# Altium schematic sheet PCB_RTM_Loopback.SchDoc: RTM Loopback
size 420 x 297 mm; Author: G.K.; CompanyName: WUT; DrawnBy: G.K.; Organization: CERN; Address1: Warsaw Univeristy of Technology; Address2: Nowowiejska 15/19; Revision: -; SheetNumber: -; SheetTotal: -; EDA_Number: ARTIQ; Projet: SINARA; ModifiedBy: -; CreateDate: XX/XX/XXXX; CheckedDate: -; Title2: Test module; DivGrp: ISE; Designer: G.K.; ModifiedDate: -; ProjectName: SINARA
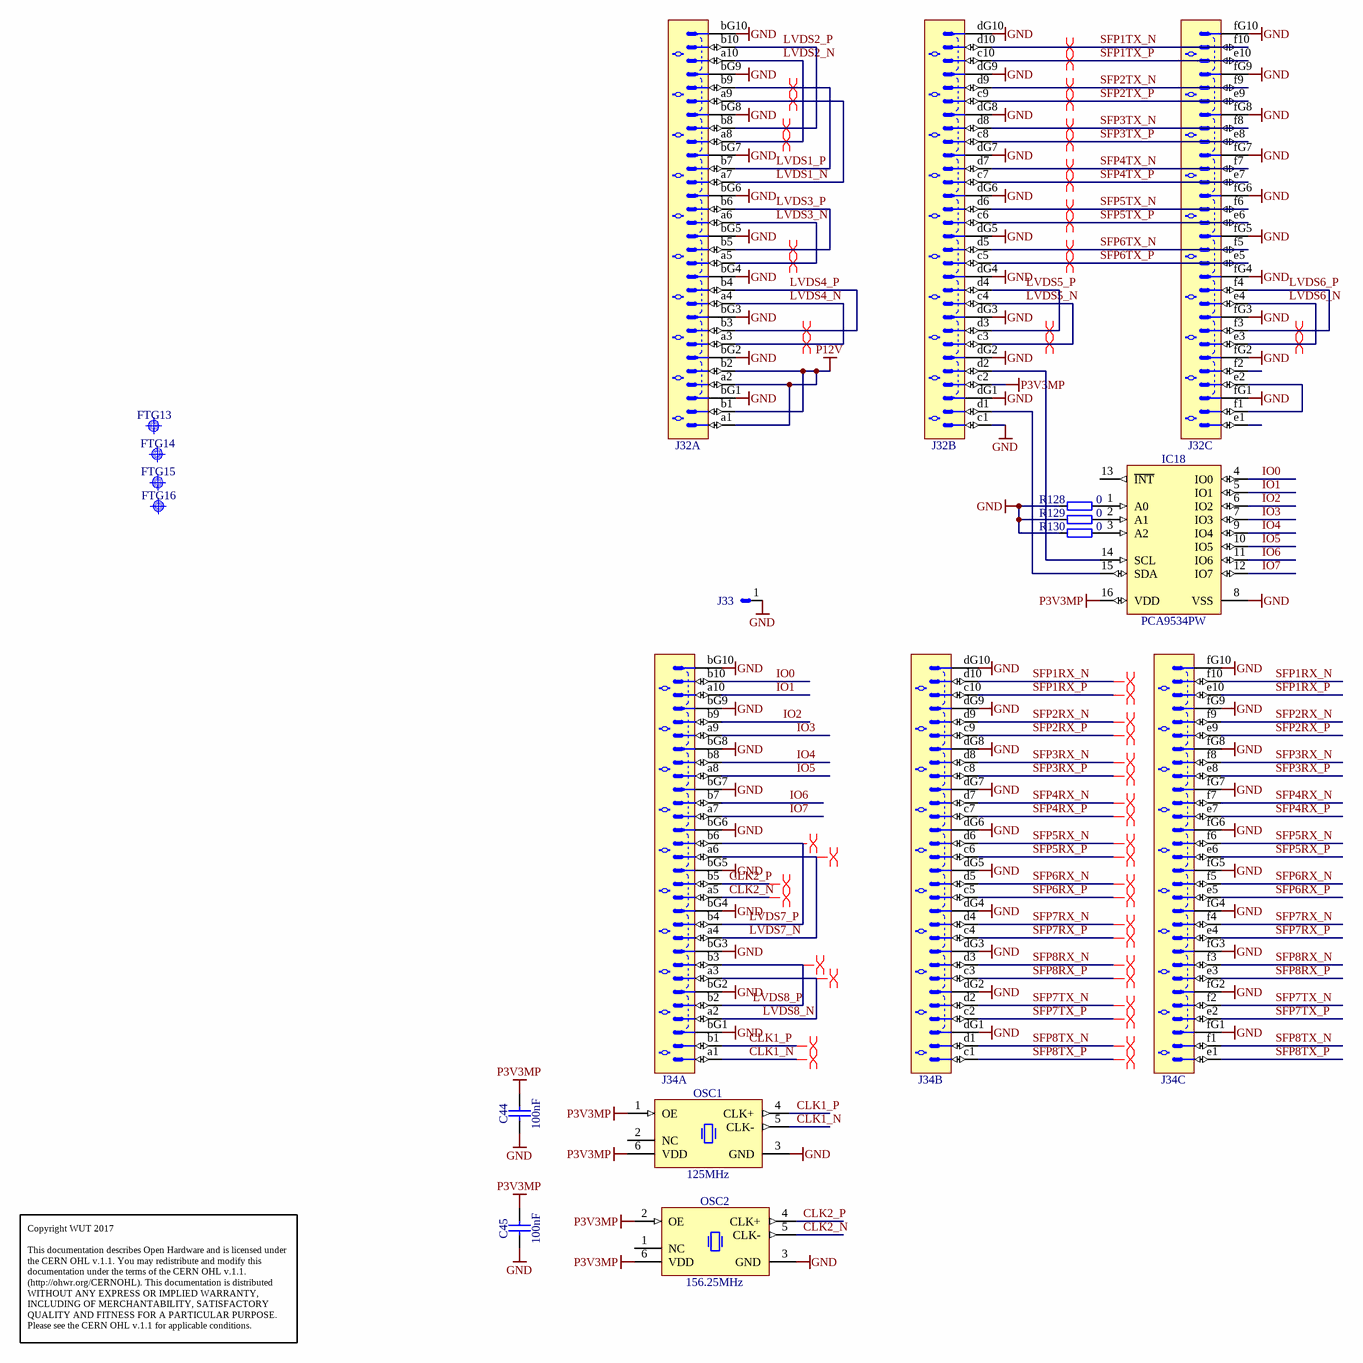
[diagram p0: PCB_RTM_Loopback.SchDoc]

## Parts
C44  100nF  [CAPC1005X55N]
C45  100nF  [CAPC1005X55N]
FTG13  Use only in PCB  [FIDUCIAL_TOP_C100-200]  (value not drawn)
FTG14  Use only in PCB  [FIDUCIAL_TOP_S100-200]  (value not drawn)
FTG15  Use only in PCB  [FIDUCIAL_TOP_S200-400]  (value not drawn)
FTG16  Use only in PCB  [FIDUCIAL_TOP_S100-200]  (value not drawn)
IC18  PCA9534PW  [SOP65P640X110-16N]
J32  (no value)  [TYCO_6469183-1]  (parts A,B,C of 3)
J33  (no value)  [TYCO_1469265-1]
J34  (no value)  [TYCO_6469183-1]  (parts A,B,C of 3)
OSC1  125MHz  [OSC_SILICON-LAB_SI531]
OSC2  156.25MHz  [OSC_SILICON-LAB_SI530]
R128  0  [RESC1005X40N]
R129  0  [RESC1005X40N]
R130  0  [RESC1005X40N]

## Nets
GND: C44.1 C45.1 IC18.8(VSS) J32.bG1 J32.bG2 J32.bG3 J32.bG4 J32.bG5 J32.bG6 J32.bG7 J32.bG8 J32.bG9 J32.bG10 J32.c1 J32.dG1 J32.dG2 J32.dG3 J32.dG4 J32.dG5 J32.dG6 J32.dG7 J32.dG8 J32.dG9 J32.dG10 J32.fG1 J32.fG2 J32.fG3 J32.fG4 J32.fG5 J32.fG6 J32.fG7 J32.fG8 J32.fG9 J32.fG10 J33.1 J34.bG1 J34.bG2 J34.bG3 J34.bG4 J34.bG5 J34.bG6 J34.bG7 J34.bG8 J34.bG9 J34.bG10 J34.dG1 J34.dG2 J34.dG3 J34.dG4 J34.dG5 J34.dG6 J34.dG7 J34.dG8 J34.dG9 J34.dG10 J34.fG1 J34.fG2 J34.fG3 J34.fG4 J34.fG5 J34.fG6 J34.fG7 J34.fG8 J34.fG9 J34.fG10 OSC1.3(GND) OSC2.3(GND) R128.1 R129.1 R130.1
P3V3MP: C44.2 C45.2 IC18.16(VDD) J32.c2 OSC1.1(OE) OSC1.6(VDD) OSC2.2(OE) OSC2.6(VDD)
P12V: J32.a1 J32.a2 J32.b1 J32.b2
CLK1_N: J34.a1 OSC1.5(CLK-)
CLK1_P: J34.b1 OSC1.4(CLK+)
CLK2_N: J34.a5 OSC2.5(CLK-)
CLK2_P: J34.b5 OSC2.4(CLK+)
IO0: IC18.4(IO0) J34.b10
IO1: IC18.5(IO1) J34.a10
IO2: IC18.6(IO2) J34.b9
IO3: IC18.7(IO3) J34.a9
IO4: IC18.9(IO4) J34.b8
IO5: IC18.10(IO5) J34.a8
IO6: IC18.11(IO6) J34.b7
IO7: IC18.12(IO7) J34.a7
LVDS1_N: J32.a7 J32.a9
LVDS1_P: J32.b7 J32.b9
LVDS2_N: J32.a8 J32.a10
LVDS2_P: J32.b8 J32.b10
LVDS3_N: J32.a5 J32.a6
LVDS3_P: J32.b5 J32.b6
LVDS4_N: J32.a3 J32.a4
LVDS4_P: J32.b3 J32.b4
LVDS5_N: J32.c3 J32.c4
LVDS5_P: J32.d3 J32.d4
LVDS6_N: J32.e3 J32.e4
LVDS6_P: J32.f3 J32.f4
LVDS7_N: J34.a4 J34.a6
LVDS7_P: J34.b4 J34.b6
LVDS8_N: J34.a2 J34.a3
LVDS8_P: J34.b2 J34.b3
SFP1RX_N: J34.d10 J34.f10
SFP1RX_P: J34.c10 J34.e10
SFP1TX_N: J32.d10 J32.f10
SFP1TX_P: J32.c10 J32.e10
SFP2RX_N: J34.d9 J34.f9
SFP2RX_P: J34.c9 J34.e9
SFP2TX_N: J32.d9 J32.f9
SFP2TX_P: J32.c9 J32.e9
SFP3RX_N: J34.d8 J34.f8
SFP3RX_P: J34.c8 J34.e8
SFP3TX_N: J32.d8 J32.f8
SFP3TX_P: J32.c8 J32.e8
SFP4RX_N: J34.d7 J34.f7
SFP4RX_P: J34.c7 J34.e7
SFP4TX_N: J32.d7 J32.f7
SFP4TX_P: J32.c7 J32.e7
SFP5RX_N: J34.d6 J34.f6
SFP5RX_P: J34.c6 J34.e6
SFP5TX_N: J32.d6 J32.f6
SFP5TX_P: J32.c6 J32.e6
SFP6RX_N: J34.d5 J34.f5
SFP6RX_P: J34.c5 J34.e5
SFP6TX_N: J32.d5 J32.f5
SFP6TX_P: J32.c5 J32.e5
SFP7RX_N: J34.d4 J34.f4
SFP7RX_P: J34.c4 J34.e4
SFP7TX_N: J34.d2 J34.f2
SFP7TX_P: J34.c2 J34.e2
SFP8RX_N: J34.d3 J34.f3
SFP8RX_P: J34.c3 J34.e3
SFP8TX_N: J34.d1 J34.f1
SFP8TX_P: J34.c1 J34.e1
NetIC18_1: IC18.1(A0) R128.2
NetIC18_2: IC18.2(A1) R129.2
NetIC18_3: IC18.3(A2) R130.2
NetIC18_14: IC18.14(SCL) J32.d2
NetIC18_15: IC18.15(SDA) J32.d1
NetJ32_e2: J32.e2 J32.f1

Not connected (* = marked no-connect by the designer): IC18 13(~{INT}); J32 e1 f2; OSC1 2(NC); OSC2 1(NC)

## Layout directives
differential pair: CLK1_N, CLK1_P, CLK2_N, CLK2_P, LVDS1_N, LVDS1_P, LVDS2_N, LVDS2_P, LVDS3_N, LVDS3_P, LVDS4_N, LVDS4_P, LVDS5_N, LVDS5_P, LVDS6_N, LVDS6_P, LVDS7_N, LVDS7_P, LVDS8_N, LVDS8_P, SFP1RX_N, SFP1RX_P, SFP1TX_N, SFP1TX_P, SFP2RX_N, SFP2RX_P, SFP2TX_N, SFP2TX_P, SFP3RX_N, SFP3RX_P, SFP3TX_N, SFP3TX_P, SFP4RX_N, SFP4RX_P, SFP4TX_N, SFP4TX_P, SFP5RX_N, SFP5RX_P, SFP5TX_N, SFP5TX_P, SFP6RX_N, SFP6RX_P, SFP6TX_N, SFP6TX_P, SFP7RX_N, SFP7RX_P, SFP7TX_N, SFP7TX_P, SFP8RX_N, SFP8RX_P, SFP8TX_N, SFP8TX_P

## Notes on the sheet
- Copyright WUT 2017
  This documentation describes Open Hardware and is licensed under the CERN OHL v.1.1. You may redistribute and modify this documentation under the terms of the CERN OHL v.1.1. (http://ohwr.org/CERNOHL). This documentation is distributed WITHOUT ANY EXPRESS OR IMPLIED WARRANTY, INCLUDING OF MERCHANTABILITY, SATISFACTORY QUALITY AND FITNESS FOR A PARTICULAR PURPOSE. Please see the CERN OHL v.1.1 for applicable conditions.
- Project/Equipment
- Document
- Designer
- Drawn by
- Check.by
- File
- Last Mod.
- Print Date
- Sheet
- Size
- A3
- of
- Rev

## Library data of the parts
C44 C45 = CC0402_100NF_16V_10%_X7R: Non-polarised capacitor; Part Description: SMD Multilayer Chip Ceramic Capacitor; Manufacturer: GENERIC; Manufacturer1 Part Number: GRM155R71C104KA88D; Voltage: 16V; TC: X7R; Tolerance: ±10%; Part Number: CC0402_100NF_16V_10%_X7R; Component Kind: Standard; Component Type: Standard; Pin Count: 2; Value: 100nF; Status: Not Recommended; Manufacturer Part Number: CC0402_100NF_16V_10%_X7R; Case: 0402; Mounted: Yes; Socket: No; SMD: Yes; Sense: No; Manufacturer1 Example: MURATA; Manufacturer1 ComponentHeight: 0.55mm; HelpURL: \\cern.ch\dfs\Applications\Altium\Datasheets\CC0402_X7R_MURATA_GRM.pdf; Author: CERN DEM JLC; CreateDate: 05.12.2013; LatestRevisionDate: 03.12.2007
FTG13 = FIDUCIAL_TARGET_C100-200: Fiducial Target; Part Description: Round Fiducial Target, Top Layer, 1.0mm, Top Solder 2.0mm, Keepout =2.0mm; Mounted: No; Part Number: FIDUCIAL_TARGET_C100-200; Component Kind: Standard (No BOM); Component Type: Standard (No BOM); Pin Count: 1; Family: Fiducial; Socket: No; SMD: Yes; Sense: No; Status: None; ComponentHeight: 0mm; HelpURL: Undefined; Author: CERN DEM JLC; CreateDate: 09.02.2010; LatestRevisionDate: 04.04.2012; PackageDescription: Round Fiducial Target, Top Layer, 1.0mm, Top Solder 2.0mm, Keepout =2.0mm
FTG14 FTG16 = FIDUCIAL_TARGET_S100-200: Fiducial Target; Part Description: Square Fiducial Target, Top Layer, 1.0mm, Top Solder 2.0mm, Keepout =2.0mm; Mounted: No; Part Number: FIDUCIAL_TARGET_S100-200; Component Kind: Standard (No BOM); Component Type: Standard (No BOM); Pin Count: 1; Family: Fiducial; Socket: No; SMD: Yes; Sense: No; Status: None; ComponentHeight: 0mm; HelpURL: Undefined; Author: CERN DEM JLC; CreateDate: 09.02.2010; LatestRevisionDate: 04.04.2012; PackageDescription: Square Fiducial Target, Top Layer, 1.0mm, Top Solder 2.0mm, Keepout =2.0mm
FTG15 = FIDUCIAL_TARGET_S200-400: Fiducial Target; Part Description: Square Fiducial Target, Top Layer, 2.0mm, Top Solder 4.0mm, Keepout =4.0mm; Mounted: No; Part Number: FIDUCIAL_TARGET_S200-400; Component Kind: Standard (No BOM); Component Type: Standard (No BOM); Pin Count: 1; Family: Fiducial; Socket: No; SMD: Yes; Sense: No; Status: None; ComponentHeight: 0mm; HelpURL: Undefined; Author: CERN DEM JLC; CreateDate: 02.06.2008; LatestRevisionDate: 04.04.2012; PackageDescription: Square Fiducial Target, Top Layer, 2.0mm, Top Solder 4.0mm, Keepout =4.0mm
IC18 = PCA9534PW: 8-Bit I2C-Bus and SMBus Low Power I/O Port with Interrupt; Manufacturer: ANALOG DEVICES; PressFit: No; Bonding: No; Part Number: PCA9534PW; Component Kind: Standard; Component Type: Standard; Device: PCA9534PW; PackageDescription: SOP, 0.65mm pitch; 16 pin, 4.40mm W X 5.00mm L X 1.10mm H body IPC Medium Density; Part Description: 8-Bit I2C-Bus and SMBus Low Power I/O Port with Interrupt; Manufacturer Part Number: PCA9534PW; Pin Count: 16; Case: SSOP16; Mounted: Yes; Socket: No; SMD: Yes; Sense: No; ComponentHeight: 1.1mm; Author: CERN DEM JLC; HelpURL: \\cern.ch\dfs\Applications\Altium\Datasheets\PCA9534PW.pdf; CreateDate: 18.12.2013; LatestRevisionDate: 18.12.2013
J32 J34 = TYCO_6469183-1: Connector 60 ATCA Male 30 Pairs (60 Signals) + 3x10 Ground; Part Number: TYCO_6469183-1
J33 = TYCO_1469265-1: Single Pin Male; Part Number: TYCO_1469265-1
OSC1 = OSC_125MHZ_SILICON-LAB_531BC125M000DG: 10-1400MHz, Crystal Oscillator (XO), Si531 Series; Part Description: 3.3V ±20ppm LVDS Crystal Oscillator (XO), Si531 Series; Manufacturer: SILICON LABS; PressFit: No; Bonding: No; Part Number: OSC_125MHZ_SILICON-LAB_531BC125M000DG; Component Kind: Standard; Component Type: Standard; PackageDescription: Oscillator Si531 Series, 6 pins, 5x7mm; Value: 125MHz; Manufacturer Part Number: 531BC125M000DG; Pin Count: 6; Mounted: Yes; Socket: No; SMD: Yes; Sense: No; ComponentHeight: 1.8mm; HelpURL: \\cern.ch\dfs\Applications\Altium\Datasheets\OSC_SILICON-LAB_SI531.pdf; Author: CERN DEM MR; CreateDate: 16.03.2016; LatestRevisionDate: 16.03.2016
OSC2 = OSC_156.25MHZ_SILICON-LAB_530BC156M250DG: 10-1400MHz, Crystal Oscillator (XO), Si530 Series; Part Description: 3.3V ±20ppm LVDS Crystal Oscillator (XO), Si530 Series; Manufacturer: SILICON LABS; PressFit: No; Bonding: No; Part Number: OSC_156.25MHZ_SILICON-LAB_530BC156M250DG; Component Kind: Standard; Component Type: Standard; PackageDescription: Oscillator Si530 Series, 6 pins, 5x7mm; Value: 156.25MHz; Manufacturer Part Number: 530BC156M250DG; Pin Count: 6; Mounted: Yes; Socket: No; SMD: Yes; Sense: No; ComponentHeight: 1.8mm; HelpURL: \\cern.ch\dfs\Applications\Altium\Datasheets\OSC_SILICON-LAB_SI530.pdf; Author: CERN DEM MR; CreateDate: 01.02.2016; LatestRevisionDate: 16.03.2016
R128-R130 = R0402_0R_JUMPER: Resistor; Part Description: 1A (0.05R Max DC Resistance) Zero Ohm Jumper; Manufacturer: GENERIC; Manufacturer1 Part Number: 232270591001L; Part Number: R0402_0R_JUMPER; Component Kind: Standard; Component Type: Standard; Pin Count: 2; Value: 0; Status: Not recommended; Manufacturer Part Number: R0402_0R_JUMPER; Case: 0402; Mounted: Yes; Sense: No; Socket: No; SMD: Yes; Manufacturer1 Example: YAGEO PHYCOMP; Manufacturer1 ComponentHeight: 0.4mm; HelpURL: \\cern.ch\dfs\Applications\Altium\Datasheets\R0402_Phycomp_RC0402.pdf; Author: CERN DEM JLC; CreateDate: 03.12.2007; LatestRevisionDate: 17.10.2012